# EAGLE design House_Illumination (EAGLE 7.5.0)
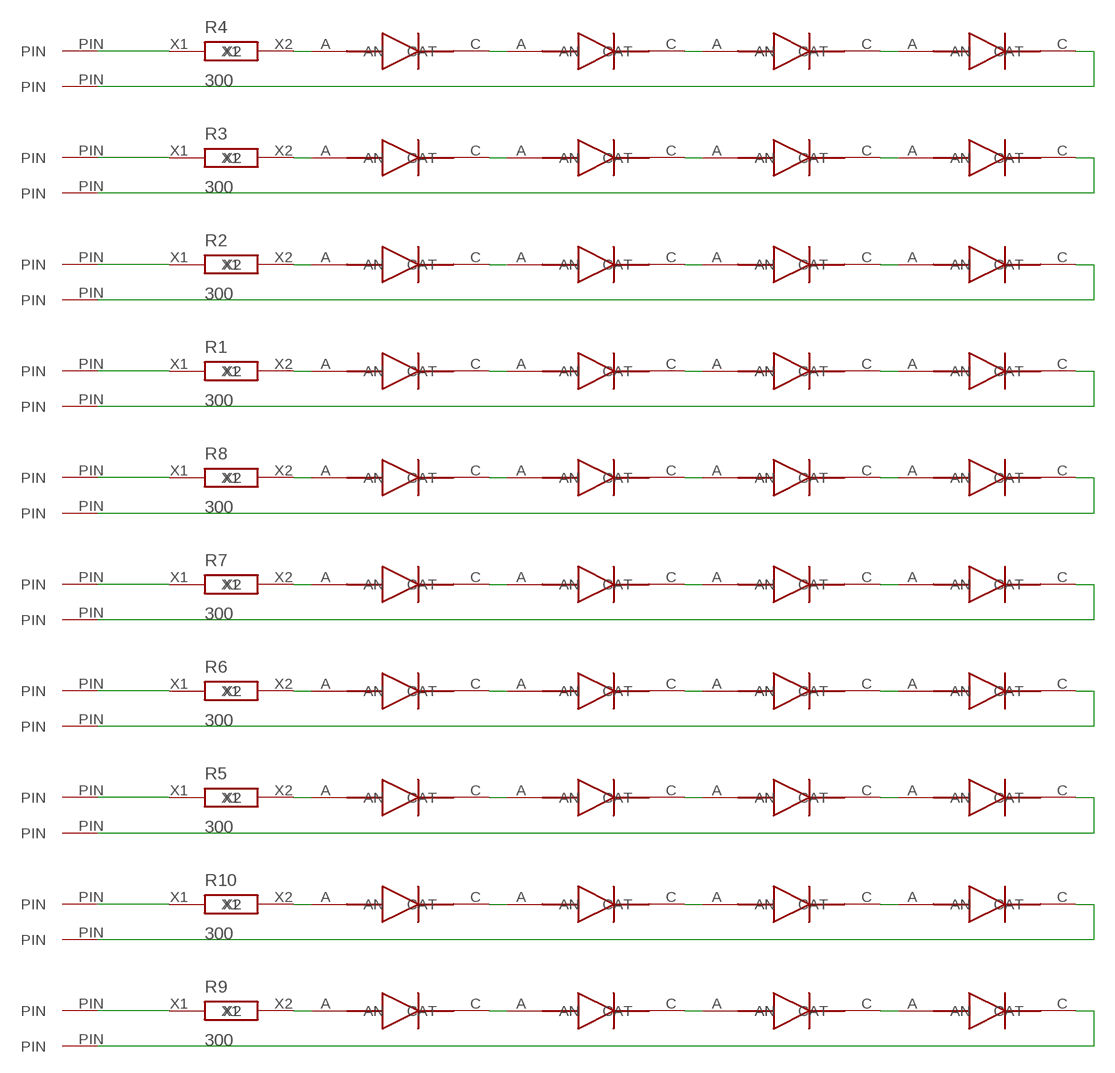
[diagram p0: schematic, sheet 1]

## Parts
R1  300  R_SMD_2.1X1.25  [SMD_2.1X1.25]
R2  300  R_SMD_2.1X1.25  [SMD_2.1X1.25]
R3  300  R_SMD_2.1X1.25  [SMD_2.1X1.25]
R4  300  R_SMD_2.1X1.25  [SMD_2.1X1.25]
R5  300  R_SMD_2.1X1.25  [SMD_2.1X1.25]
R6  300  R_SMD_2.1X1.25  [SMD_2.1X1.25]
R7  300  R_SMD_2.1X1.25  [SMD_2.1X1.25]
R8  300  R_SMD_2.1X1.25  [SMD_2.1X1.25]
R9  300  R_SMD_2.1X1.25  [SMD_2.1X1.25]
R10  300  R_SMD_2.1X1.25  [SMD_2.1X1.25]
U$1  PIN_1  [PIN_1]
U$2  PIN_1  [PIN_1]
U$3  LED0805  [LED0805]
U$4  LED0805  [LED0805]
U$5  LED0805  [LED0805]
U$6  LED0805  [LED0805]
U$7  PIN_1  [PIN_1]
U$8  PIN_1  [PIN_1]
U$9  LED0805  [LED0805]
U$10  LED0805  [LED0805]
U$11  LED0805  [LED0805]
U$12  LED0805  [LED0805]
U$13  PIN_1  [PIN_1]
U$14  PIN_1  [PIN_1]
U$15  LED0805  [LED0805]
U$16  LED0805  [LED0805]
U$17  LED0805  [LED0805]
U$18  LED0805  [LED0805]
U$19  PIN_1  [PIN_1]
U$20  PIN_1  [PIN_1]
U$21  LED0805  [LED0805]
U$22  LED0805  [LED0805]
U$23  LED0805  [LED0805]
U$24  LED0805  [LED0805]
U$25  PIN_1  [PIN_1]
U$26  PIN_1  [PIN_1]
U$27  LED0805  [LED0805]
U$28  LED0805  [LED0805]
U$29  LED0805  [LED0805]
U$30  LED0805  [LED0805]
U$31  PIN_1  [PIN_1]
U$32  PIN_1  [PIN_1]
U$33  LED0805  [LED0805]
U$34  LED0805  [LED0805]
U$35  LED0805  [LED0805]
U$36  LED0805  [LED0805]
U$37  PIN_1  [PIN_1]
U$38  PIN_1  [PIN_1]
U$39  LED0805  [LED0805]
U$40  LED0805  [LED0805]
U$41  LED0805  [LED0805]
U$42  LED0805  [LED0805]
U$43  PIN_1  [PIN_1]
U$44  PIN_1  [PIN_1]
U$45  LED0805  [LED0805]
U$46  LED0805  [LED0805]
U$47  LED0805  [LED0805]
U$48  LED0805  [LED0805]
U$49  PIN_1  [PIN_1]
U$50  PIN_1  [PIN_1]
U$51  LED0805  [LED0805]
U$52  LED0805  [LED0805]
U$53  LED0805  [LED0805]
U$54  LED0805  [LED0805]
U$55  PIN_1  [PIN_1]
U$56  PIN_1  [PIN_1]
U$57  LED0805  [LED0805]
U$58  LED0805  [LED0805]
U$59  LED0805  [LED0805]
U$60  LED0805  [LED0805]

## Nets
N$1: R1.X1 U$1.PIN
N$2: R1.X2 U$3.A(AN)
N$3: U$3.C(CAT) U$4.A(AN)
N$4: U$4.C(CAT) U$5.A(AN)
N$5: U$5.C(CAT) U$6.A(AN)
N$6: U$2.PIN U$6.C(CAT)
N$7: R2.X1 U$7.PIN
N$8: R2.X2 U$9.A(AN)
N$9: U$9.C(CAT) U$10.A(AN)
N$10: U$10.C(CAT) U$11.A(AN)
N$11: U$11.C(CAT) U$12.A(AN)
N$12: U$8.PIN U$12.C(CAT)
N$13: R3.X1 U$13.PIN
N$14: R3.X2 U$15.A(AN)
N$15: U$15.C(CAT) U$16.A(AN)
N$16: U$16.C(CAT) U$17.A(AN)
N$17: U$17.C(CAT) U$18.A(AN)
N$18: U$14.PIN U$18.C(CAT)
N$19: R4.X1 U$19.PIN
N$20: R4.X2 U$21.A(AN)
N$21: U$21.C(CAT) U$22.A(AN)
N$22: U$22.C(CAT) U$23.A(AN)
N$23: U$23.C(CAT) U$24.A(AN)
N$24: U$20.PIN U$24.C(CAT)
N$25: R5.X1 U$25.PIN
N$26: R5.X2 U$27.A(AN)
N$27: U$27.C(CAT) U$28.A(AN)
N$28: U$28.C(CAT) U$29.A(AN)
N$29: U$29.C(CAT) U$30.A(AN)
N$30: U$26.PIN U$30.C(CAT)
N$31: R6.X1 U$31.PIN
N$32: R6.X2 U$33.A(AN)
N$33: U$33.C(CAT) U$34.A(AN)
N$34: U$34.C(CAT) U$35.A(AN)
N$35: U$35.C(CAT) U$36.A(AN)
N$36: U$32.PIN U$36.C(CAT)
N$37: R7.X1 U$37.PIN
N$38: R7.X2 U$39.A(AN)
N$39: U$39.C(CAT) U$40.A(AN)
N$40: U$40.C(CAT) U$41.A(AN)
N$41: U$41.C(CAT) U$42.A(AN)
N$42: U$38.PIN U$42.C(CAT)
N$43: R8.X1 U$43.PIN
N$44: R8.X2 U$45.A(AN)
N$45: U$45.C(CAT) U$46.A(AN)
N$46: U$46.C(CAT) U$47.A(AN)
N$47: U$47.C(CAT) U$48.A(AN)
N$48: U$44.PIN U$48.C(CAT)
N$49: R9.X1 U$49.PIN
N$50: R9.X2 U$51.A(AN)
N$51: U$51.C(CAT) U$52.A(AN)
N$52: U$52.C(CAT) U$53.A(AN)
N$53: U$53.C(CAT) U$54.A(AN)
N$54: U$50.PIN U$54.C(CAT)
N$55: R10.X1 U$55.PIN
N$56: R10.X2 U$57.A(AN)
N$57: U$57.C(CAT) U$58.A(AN)
N$58: U$58.C(CAT) U$59.A(AN)
N$59: U$59.C(CAT) U$60.A(AN)
N$60: U$56.PIN U$60.C(CAT)

## Library data of the parts
R1-R10 = MyPowerComponents:R_SMD_2.1X1.25
U$1 U$2 U$7 U$8 U$13 U$14 U$19 U$20 U$25 U$26 U$31 U$32 U$37 U$38 U$43 U$44 U$49 U$50 U$55 U$56 = My_BLE:PIN_1
U$3-U$6 U$9-U$12 U$15-U$18 U$21-U$24 U$27-U$30 U$33-U$36 U$39-U$42 U$45-U$48 U$51-U$54 U$57-U$60 = My_FTDI:LED0805

## Board
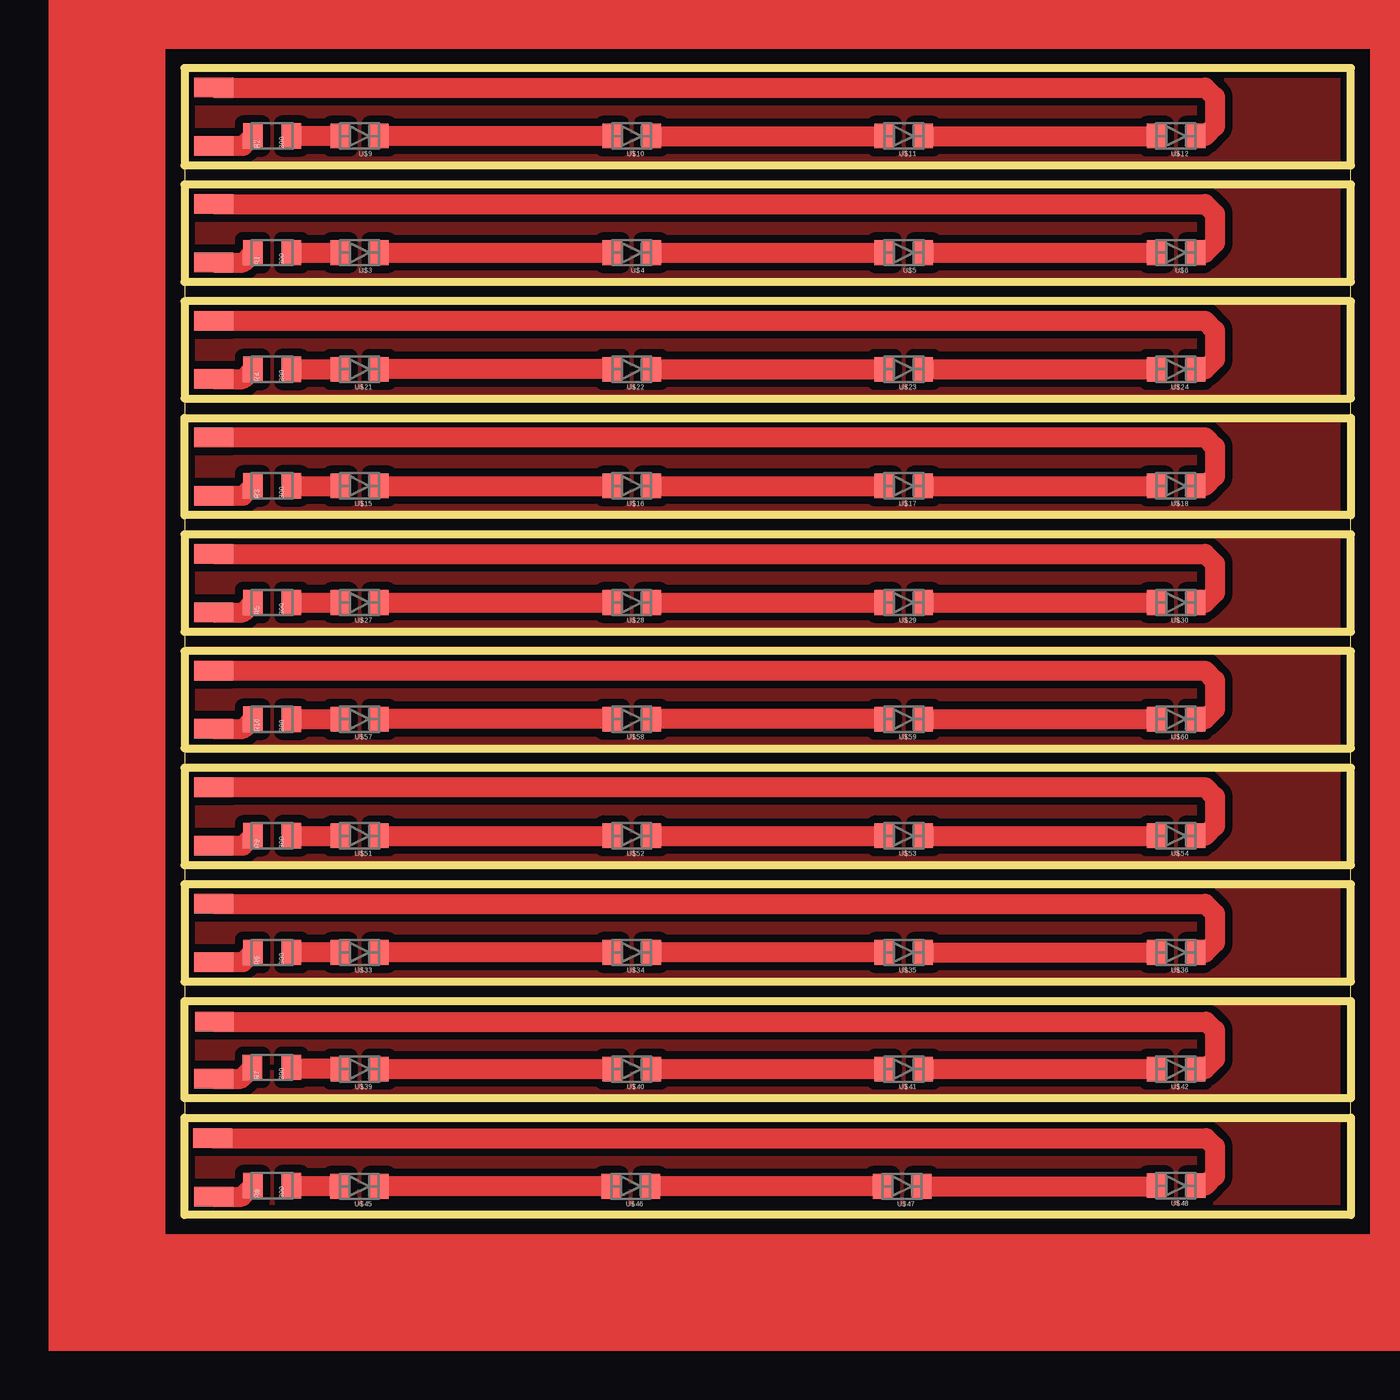
[diagram p1: board, top side]

Size 60 x 59 mm. Coordinates in mm from the lower left corner, seen from the top.
Outline: 0,0 60,0 60,59 0,59 0,0
Copper layers (1*16): Top 0.035mm / dielectric 1.5mm / Bottom 0.035mm
Design rules "default *": minimum track width 10mil, minimum drill 24mil, track to track 8mil, track to pad 8mil, pad to pad 8mil, via to via 8mil, smd to smd 8mil, copper to edge 20mil, drill to drill 8mil, minimum pad ring 10mil, minimum via ring 8mil, stop-mask expansion 4mil, vias tented up to drill 0mil, thermal gap 10mil
Milling: 40 lines

### Footprints (pad centres in the part's own frame; a part is rotated, then mirrored left to right if it is on the bottom)
SMD_2.1X1.25 = smd 1.3 x 1: X1 0,1; X2 0,-1
PIN_1 = smd 2 x 1: PIN 0,0
LED0805 = smd 1.27 x 1: A 0,1; C 0,-1

### Placement (x,y rotation side)
R1  4.5,49.5 90 top
R2  4.5,55.5 90 top
R3  4.5,37.5 90 top
R4  4.5,43.5 90 top
R5  4.5,31.5 90 top
R6  4.5,13.5 90 top
R7  4.49,7.59 90 top
R8  4.5,1.5 90 top
R9  4.5,19.5 90 top
R10  4.5,25.5 90 top
U$1  1.5,49 0 top
U$2  1.5,52 0 top
U$3  9,49.5 90 top
U$4  23,49.5 90 top
U$5  37,49.5 90 top
U$6  51,49.5 90 top
U$7  1.5,55 0 top
U$8  1.5,58 0 top
U$9  9,55.5 90 top
U$10  23,55.5 90 top
U$11  37,55.5 90 top
U$12  51,55.5 90 top
U$13  1.5,37 0 top
U$14  1.5,40 0 top
U$15  9,37.5 90 top
U$16  23,37.5 90 top
U$17  37,37.5 90 top
U$18  51,37.5 90 top
U$19  1.5,43 0 top
U$20  1.5,46 0 top
U$21  9,43.5 90 top
U$22  23,43.5 90 top
U$23  37,43.5 90 top
U$24  51,43.5 90 top
U$25  1.5,31 0 top
U$26  1.5,34 0 top
U$27  9,31.5 90 top
U$28  23,31.5 90 top
U$29  37,31.5 90 top
U$30  51,31.5 90 top
U$31  1.5,13 0 top
U$32  1.5,16 0 top
U$33  9,13.5 90 top
U$34  23,13.5 90 top
U$35  37,13.5 90 top
U$36  51,13.5 90 top
U$37  1.5,7 0 top
U$38  1.53,9.94 0 top
U$39  9,7.5 90 top
U$40  23,7.5 90 top
U$41  37,7.5 90 top
U$42  51,7.5 90 top
U$43  1.49,0.94 0 top
U$44  1.45,3.94 0 top
U$45  8.99,1.47 90 top
U$46  22.95,1.47 90 top
U$47  36.91,1.47 90 top
U$48  51,1.5 90 top
U$49  1.5,19 0 top
U$50  1.5,22 0 top
U$51  9,19.5 90 top
U$52  23,19.5 90 top
U$53  37,19.5 90 top
U$54  51,19.5 90 top
U$55  1.5,25 0 top
U$56  1.5,28 0 top
U$57  9,25.5 90 top
U$58  23,25.5 90 top
U$59  37,25.5 90 top
U$60  51,25.5 90 top

### Tracks (layer width: path | path; a pad name or v marks a point on that pad's centre or on a via)
GND
  pour Top (isolate 0.406): 0,0 60,0 60,5 0,5
  pour Top (isolate 0.406): 0,6 60,6 60,11 0,11
  pour Top (isolate 0.406): 0,12 60,12 60,17 0,17
  pour Top (isolate 0.406): 0,18 60,18 60,23 0,23
  pour Top (isolate 0.406): 0,24 60,24 60,29 0,29
  pour Top (isolate 0.406): 0,30 60,30 60,35 0,35
  pour Top (isolate 0.406): 0,36 60,36 60,41 0,41
  pour Top (isolate 0.406): 0,42 60,42 60,47 0,47
  pour Top (isolate 0.406): 0,48 60,48 60,53 0,53
  pour Top (isolate 0.406): 0,54 60,54 60,59 0,59
N$1
  Top 1.016: U$1.PIN 3,49 R1.X1
N$2
  Top 1.016: R1.X2 U$3.A
N$3
  Top 1.016: U$3.C U$4.A
N$4
  Top 1.016: U$4.C U$5.A
N$5
  Top 1.016: U$5.C U$6.A
N$6
  Top 1.016: U$2.PIN 52.5,52 53,51.5 53,50 52.5,49.5 U$6.C
N$7
  Top 1.016: U$7.PIN 3,55 R2.X1
N$8
  Top 1.016: U$9.A R2.X2
N$9
  Top 1.016: U$10.A U$9.C
N$10
  Top 1.016: U$10.C U$11.A
N$11
  Top 1.016: U$11.C U$12.A
N$12
  Top 1.016: U$8.PIN 52.5,58 53,57.5 53,56 52.5,55.5 U$12.C
N$13
  Top 1.016: U$13.PIN 3,37 R3.X1
N$14
  Top 1.016: R3.X2 U$15.A
N$15
  Top 1.016: U$15.C U$16.A
N$16
  Top 1.016: U$16.C U$17.A
N$17
  Top 1.016: U$17.C U$18.A
N$18
  Top 1.016: U$14.PIN 52.5,40 53,39.5 53,38 52.5,37.5 U$18.C
N$19
  Top 1.016: U$19.PIN 3,43 R4.X1
N$20
  Top 1.016: R4.X2 U$21.A
N$21
  Top 1.016: U$22.A U$21.C
N$22
  Top 1.016: U$22.C U$23.A
N$23
  Top 1.016: U$23.C U$24.A
N$24
  Top 1.016: U$20.PIN 52.5,46 53,45.5 53,44 52.5,43.5 U$24.C
N$25
  Top 1.016: U$25.PIN 3,31 R5.X1
N$26
  Top 1.016: R5.X2 U$27.A
N$27
  Top 1.016: U$27.C U$28.A
N$28
  Top 1.016: U$28.C U$29.A
N$29
  Top 1.016: U$29.C U$30.A
N$30
  Top 1.016: U$26.PIN 52.5,34 53,33.5 53,32 52.5,31.5 U$30.C
N$31
  Top 1.016: U$31.PIN 3,13 R6.X1
N$32
  Top 1.016: U$33.A R6.X2
N$33
  Top 1.016: U$34.A U$33.C
N$34
  Top 1.016: U$35.A U$34.C
N$35
  Top 1.016: U$35.C U$36.A
N$36
  Top 1.016: U$32.PIN 52.5,16 53,15.5 53,14 52.5,13.5 U$36.C
N$37
  Top 1.016: U$37.PIN 2.9,7 R7.X1
N$38
  Top 1.016: U$39.A 5.58,7.5 R7.X2
N$39
  Top 1.016: U$39.C U$40.A
N$40
  Top 1.016: U$40.C U$41.A
N$41
  Top 1.016: U$41.C U$42.A
N$42
  Top 1.016: U$38.PIN 52.56,9.94 53,9.5 53,8 52.5,7.5 U$42.C
N$43
  Top 1.016: U$43.PIN 2.94,0.94 R8.X1
N$44
  Top 1.016: R8.X2 7.96,1.5 U$45.A
N$45
  Top 1.016: U$46.A U$45.C
N$46
  Top 1.016: U$47.A U$46.C
N$47
  Top 1.016: U$47.C 49.97,1.47 U$48.A
N$48
  Top 1.016: U$44.PIN 52.56,3.94 53,3.5 53,2 52.5,1.5 U$48.C
N$49
  Top 1.016: U$49.PIN 3,19 R9.X1
N$50
  Top 1.016: R9.X2 U$51.A
N$51
  Top 1.016: U$51.C U$52.A
N$52
  Top 1.016: U$52.C U$53.A
N$53
  Top 1.016: U$53.C U$54.A
N$54
  Top 1.016: U$50.PIN 52.5,22 53,21.5 53,20 52.5,19.5 U$54.C
N$55
  Top 1.016: U$55.PIN 3,25 R10.X1
N$56
  Top 1.016: R10.X2 U$57.A
N$57
  Top 1.016: U$58.A U$57.C
N$58
  Top 1.016: U$59.A U$58.C
N$59
  Top 1.016: U$59.C U$60.A
N$60
  Top 1.016: U$56.PIN 52.5,28 53,27.5 53,26 52.5,25.5 U$60.C
(copper drawn outside any net)
  shapes: Top area x5